# Altium schematic sheet POWER.SchDoc
size A4; Date: 2020/05/29
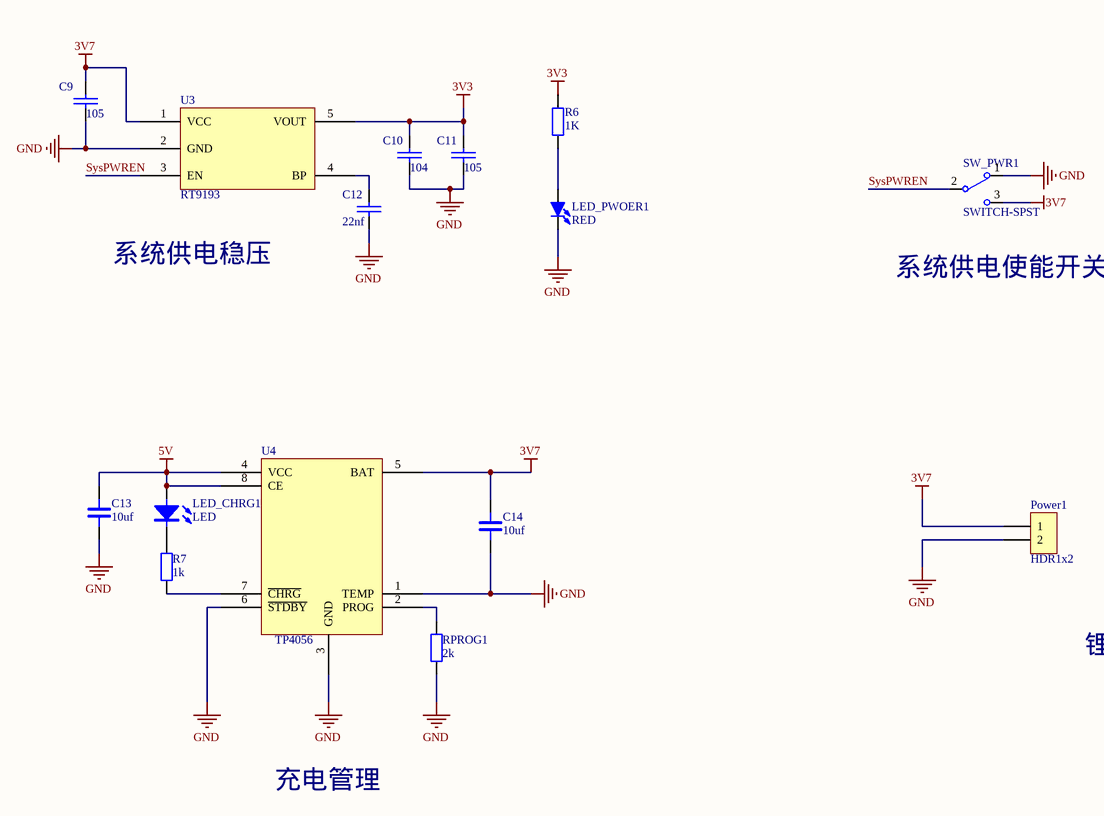
[diagram p0: POWER.SchDoc]

## Parts
C9  105  [C 0603_M]
C10  104  [C 0603_M]
C11  105  [C 0603_M]
C12  22nf  [C 0603_M]
C13  10uf  [C 0805_M]
C14  10uf  [C 0805_M]
LED_CHRG1  LED  [LED 0603G]
LED_PWOER1  RED  [LED 0603R]
Power1  HDR1x2  [XH2.54-LI-2P]
R6  1K  [R 0603_M]
R7  1k  [R 0603_M]
RPROG1  2k  [R 0603_M]
SW_PWR1  SWITCH-SPST  [Switch_3p_2.5mmjianju]
U3  RT9193  [SOT-23-5]
U4  TP4056  [ESOP8]

## Nets
3V3: C10.1 C11.1 R6.2 U3.5(VOUT)
3V7: C9.1 C14.2 Power1.1 SW_PWR1.3 U3.1(VCC) U4.5(BAT)
5V: C13.2 LED_CHRG1.1(A) U4.4(VCC) U4.8(CE)
GND: C9.2 C10.2 C11.2 C12.2 C13.1 C14.1 LED_PWOER1.2(K) Power1.2 RPROG1.1 SW_PWR1.1 U3.2(GND) U4.1(TEMP) U4.3(GND) U4.6(~{STDBY})
SysPWREN: SW_PWR1.2 U3.3(EN)
NetC12_1: C12.1 U3.4(BP)
NetLED_CHRG1_2: LED_CHRG1.2(C) R7.2
NetLED_PWOER1_1: LED_PWOER1.1(A) R6.1
NetR7_1: R7.1 U4.7(~{CHRG})
NetRPROG1_2: RPROG1.2 U4.2(PROG)

## Notes on the sheet
- 系统供电稳压
- (near SW_PWR1) 系统供电使能开关
- 锂电池接口
- 充电管理
- Title:
- A4
- Name:
- Date:
- Author@
- firestaradmin

## Library data of the parts
C9-C14 = CAP: Capacitor
LED_PWOER1 = LED-SMD: 贴片LED; 版权归属: 源创客; BOM名称: 贴片LED; 学习资源: www.ooocke.com
Power1 = HDR1x2: Connector
R6 = R: 贴片电阻; 版权归属: 源创客; BOM名称: 贴片电阻; 学习资源: www.ooocke.com
R7 RPROG1 = RES: Resistor
SW_PWR1 = SWITCH-SPST: Switch